# EAGLE schematic ECE445-Transmitter-Schematic-RF-Receiver (EAGLE 7.5.0)
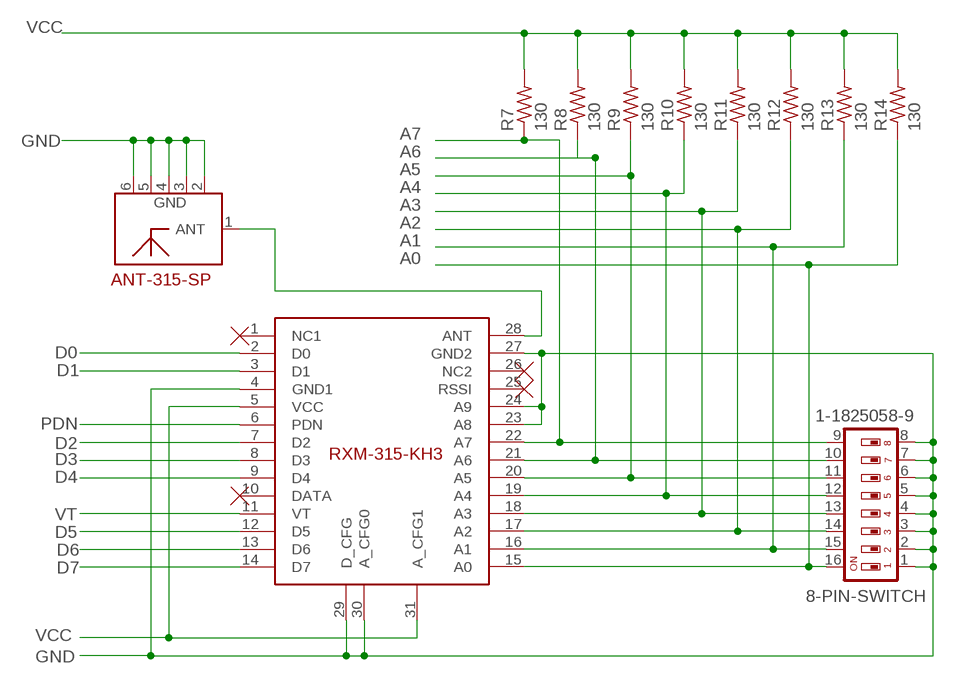
[diagram p0: schematic, sheet 1]

## Parts
8-PIN-SWITCH  1-1825058-9  SWS008  [SMS-008]
IC1  ANT-315-SP  ANT-XXX-SP  [ANT-XXX-SP]
R7  130  R-US_0204/5  [0204/5]
R8  130  R-US_0204/5  [0204/5]
R9  130  R-US_0204/5  [0204/5]
R10  130  R-US_0204/5  [0204/5]
R11  130  R-US_0204/5  [0204/5]
R12  130  R-US_0204/5  [0204/5]
R13  130  R-US_0204/5  [0204/5]
R14  130  R-US_0204/5  [0204/5]
RXM-315-KH3  KH3-RXM-LINX-315  [KH3-RXM-LINX-315]
U$1  NO_CONNECT  [NO_CONNECT]
U$4  NO_CONNECT  [NO_CONNECT]
U$5  NO_CONNECT  [NO_CONNECT]
U$6  NO_CONNECT  [NO_CONNECT]

## Nets
A0: 8-PIN-SWITCH.16 R14.1 RXM-315-KH3.15(A0)
A1: 8-PIN-SWITCH.15 R13.1 RXM-315-KH3.16(A1)
A2: 8-PIN-SWITCH.14 R12.1 RXM-315-KH3.17(A2)
A3: 8-PIN-SWITCH.13 R11.1 RXM-315-KH3.18(A3)
A4: 8-PIN-SWITCH.12 R10.1 RXM-315-KH3.19(A4)
A5: 8-PIN-SWITCH.11 R9.1 RXM-315-KH3.20(A5)
A6: 8-PIN-SWITCH.10 R8.1 RXM-315-KH3.21(A6)
A7: 8-PIN-SWITCH.9 R7.1 RXM-315-KH3.22(A7)
ANT: IC1.1(ANT) RXM-315-KH3.28(ANT)
D0: RXM-315-KH3.2(D0)
D1: RXM-315-KH3.3(D1)
D2: RXM-315-KH3.7(D2)
D3: RXM-315-KH3.8(D3)
D4: RXM-315-KH3.9(D4)
D5: RXM-315-KH3.12(D5)
D6: RXM-315-KH3.13(D6)
D7: RXM-315-KH3.14(D7)
GND: 8-PIN-SWITCH.1 8-PIN-SWITCH.2 8-PIN-SWITCH.3 8-PIN-SWITCH.4 8-PIN-SWITCH.5 8-PIN-SWITCH.6 8-PIN-SWITCH.7 8-PIN-SWITCH.8 IC1.2(GND) IC1.3(GND) IC1.4(GND) IC1.5(GND) IC1.6(GND) RXM-315-KH3.4(GND1) RXM-315-KH3.23(A8) RXM-315-KH3.24(A9) RXM-315-KH3.27(GND2) RXM-315-KH3.29(D_CFG) RXM-315-KH3.30(A_CFG0)
N$1: RXM-315-KH3.25(RSSI) U$1.P$1(NC)
N$13: RXM-315-KH3.26(NC2) U$5.P$1(NC)
N$31: RXM-315-KH3.10(DATA) U$6.P$1(NC)
N$32: RXM-315-KH3.1(NC1) U$4.P$1(NC)
PDN: RXM-315-KH3.6(PDN)
VCC: R7.2 R8.2 R9.2 R10.2 R11.2 R12.2 R13.2 R14.2 RXM-315-KH3.5(VCC) RXM-315-KH3.31(A_CFG1)
VT: RXM-315-KH3.11(VT)

## Library data of the parts
8-PIN-SWITCH = smd-special:SWS008: SMD Dip Switch 8 pol.
IC1 = linx:ANT-XXX-SP: ANT-315-SP Source: http://www.antennafactor.com/documents/ANT-315-SP_Data_Sheet.pdf; OC_FARNELL: unknown; OC_NEWARK: unknown
R7-R14 = rcl:R-US_: RESISTOR, American symbol
RXM-315-KH3 = KH3-RXM-LINX-315:KH3-RXM-LINX-315
U$1 U$4-U$6 = NO_CONNECT:NO_CONNECT